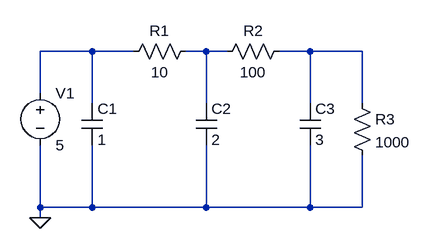
[diagram p0: schematic figure30.asc]
figure30.asc, the LTspice schematic file:
Version 4
SHEET 1 880 680
WIRE -80 80 -160 80
WIRE -16 80 -80 80
WIRE 96 80 64 80
WIRE 128 80 96 80
WIRE 256 80 208 80
WIRE 336 80 256 80
WIRE -160 144 -160 80
WIRE -80 160 -80 80
WIRE 96 160 96 80
WIRE 256 160 256 80
WIRE 336 160 336 80
WIRE -160 320 -160 224
WIRE -80 320 -80 224
WIRE -80 320 -160 320
WIRE 96 320 96 224
WIRE 96 320 -80 320
WIRE 256 320 256 224
WIRE 256 320 96 320
WIRE 336 320 336 240
WIRE 336 320 256 320
WIRE -160 336 -160 320
FLAG -160 336 0
SYMBOL voltage -160 128 R0
WINDOW 123 0 0 Left 0
WINDOW 39 0 0 Left 0
SYMATTR InstName V1
SYMATTR Value 5
SYMBOL res 80 64 R90
WINDOW 0 0 56 VBottom 2
WINDOW 3 32 56 VTop 2
SYMATTR InstName R1
SYMATTR Value 10
SYMBOL res 224 64 R90
WINDOW 0 0 56 VBottom 2
WINDOW 3 32 56 VTop 2
SYMATTR InstName R2
SYMATTR Value 100
SYMBOL res 320 144 R0
SYMATTR InstName R3
SYMATTR Value 1000
SYMBOL cap -96 160 R0
SYMATTR InstName C1
SYMATTR Value 1
SYMBOL cap 80 160 R0
SYMATTR InstName C2
SYMATTR Value 2
SYMBOL cap 240 160 R0
SYMATTR InstName C3
SYMATTR Value 3

The netlist it stands for:
* figure30.asc
V1 N001 0 5
R1 N002 N001 10
R2 N003 N002 100
R3 N003 0 1000
C1 N001 0 1
C2 N002 0 2
C3 N003 0 3
.backanno
.end